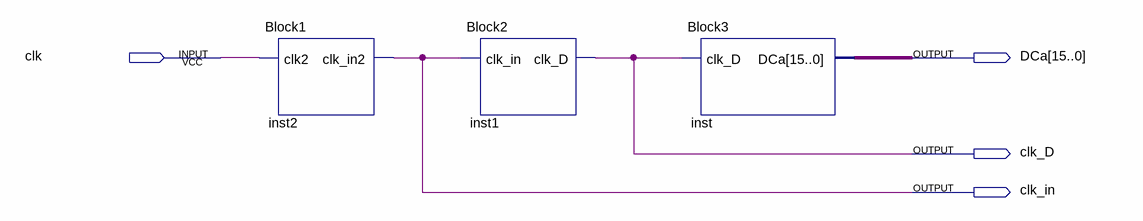
[diagram p0: schematic sheet]
// Quartus schematic Block4.bdf as structural Verilog: 3 symbols, 4 pins
module Block4 (
  input  clk,
  output [15:0] DCa,
  output clk_D,
  output clk_in
);

  Block1 inst2 (.clk2(clk), .clk_in2(clk_in));
  Block2 inst1 (.clk_in(clk_in), .clk_D(clk_D));
  Block3 inst (.clk_D(clk_D), .DCa(DCa));
endmodule
